# EAGLE design LoRa_RFM98W_Shield (EAGLE 9.6.2)
CNAME: LoRa Shield; CREVISION: V1.1

## Sheet 1 of 2
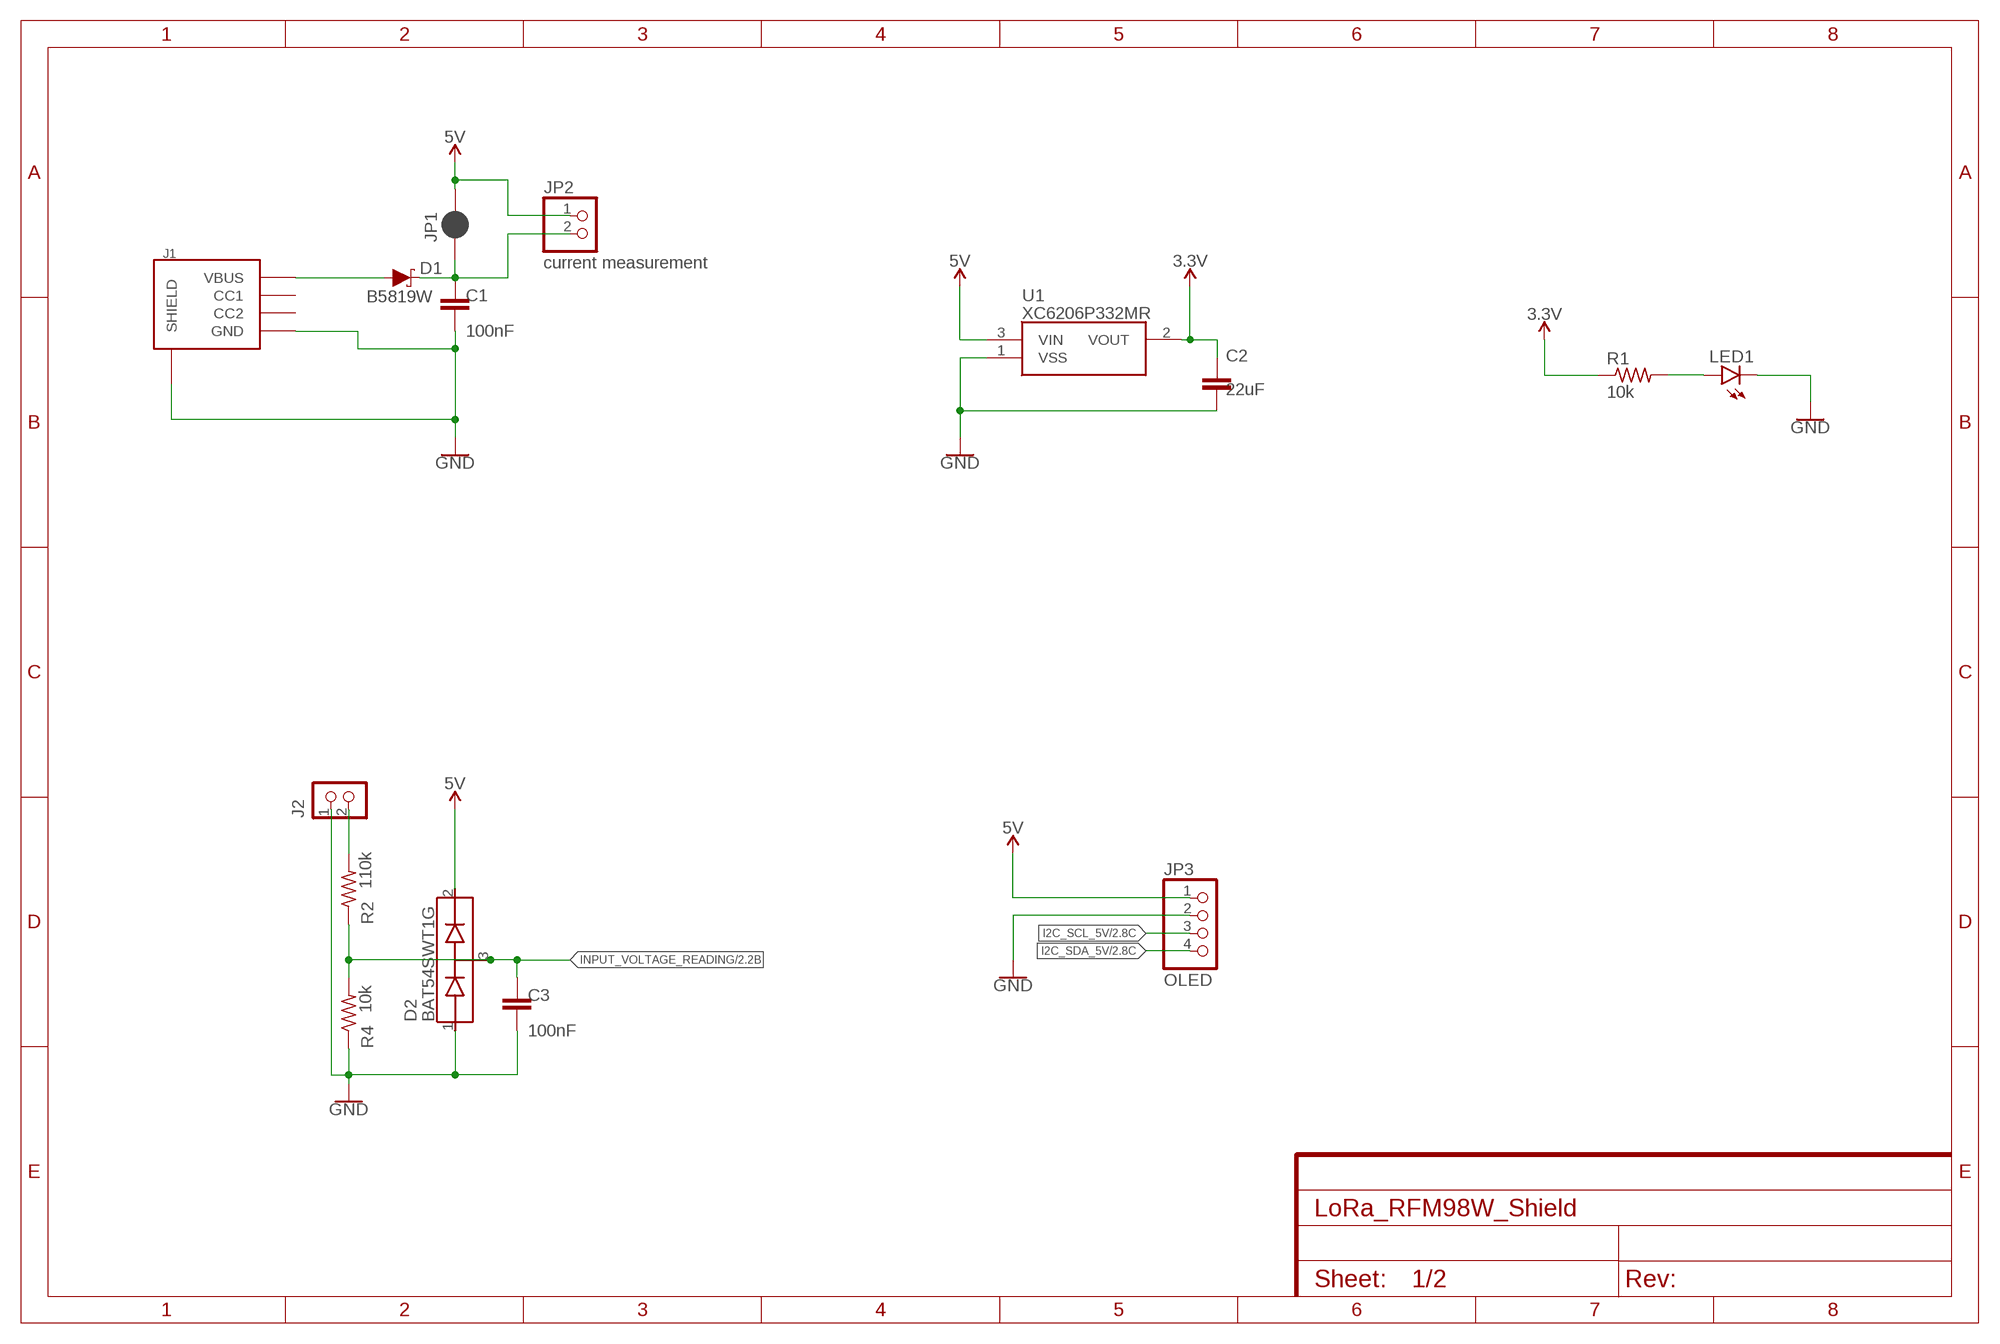
[diagram p0: schematic, sheet 1]

### Parts
C1  100nF  C-NON-POLC0603  [C0603]
C2  22uF  C-NON-POLC0805  [C0805]
C3  100nF  C-NON-POLC0603  [C0603]
D1  B5819W  DIODE-SCHOTTKY_SOD-123  [SOD-123]
D2  BAT54SWT1G  [SOT65P220X100-3N]
J1  USB-TYPE-C-31-M-17  [USB-TYPE-C-31-M-17]
J2  CON_TERMINAL_BLOCK_02-5MM  [TERMINAL_BLOCK_2P_5]
JP1  JUMPER-SMT_2_NC_PASTE_SILK  [SMT-JUMPER_2_NC_PASTE_SILK]
JP2  current measurement  PINHD-1X2/OCT  [1X02/OCT]
JP3  OLED  PINHD-1X4/OCT  [1X04/OCT]
LED1  LEDCHIPLED_0805  [CHIPLED_0805]
R1  10k  RR0603  [R0603]
R2  110k  RR0603  [R0603]
R4  10k  RR0603  [R0603]
U1  XC6206P332MR  [SOT95P280X130-3N]

### Nets
3.3V [power]: C2.2 R1.1 U1.2(VOUT) ; also sheet 2
5V [power]: D2.2(CATHODE) JP1.2 JP2.1 JP3.1 U1.3(VIN) ; also sheet 2
GND [power]: C1.2 C2.1 C3.2 D2.1(ANODE) J1.GND J1.GND_2(GND) J1.SHLD-B1(SHIELD) J1.SHLD-B2(SHIELD) J1.SHLD-B3(SHIELD) J1.SHLD-B4(SHIELD) J1.SHLD-T1(SHIELD) J1.SHLD-T2(SHIELD) J1.SHLD-T3(SHIELD) J1.SHLD-T4(SHIELD) J2.1 JP3.2 LED1.C R4.1 U1.1(VSS) ; also sheet 2
I2C_SCL_5V: JP3.3 ; also sheet 2
I2C_SDA_5V: JP3.4 ; also sheet 2
INPUT_VOLTAGE_READING: C3.1 D2.3(CATHODE-ANODE) R2.1 R4.2 ; also sheet 2
N$1 [power]: D1.A J1.VBUS J1.VBUS_2(VBUS)
N$4 [power]: LED1.A R1.2
N$8: J2.2 R2.2
N$16 [power]: C1.1 D1.C JP1.1 JP2.2
Unconnected: J1.CC1 J1.CC2

## Sheet 2 of 2
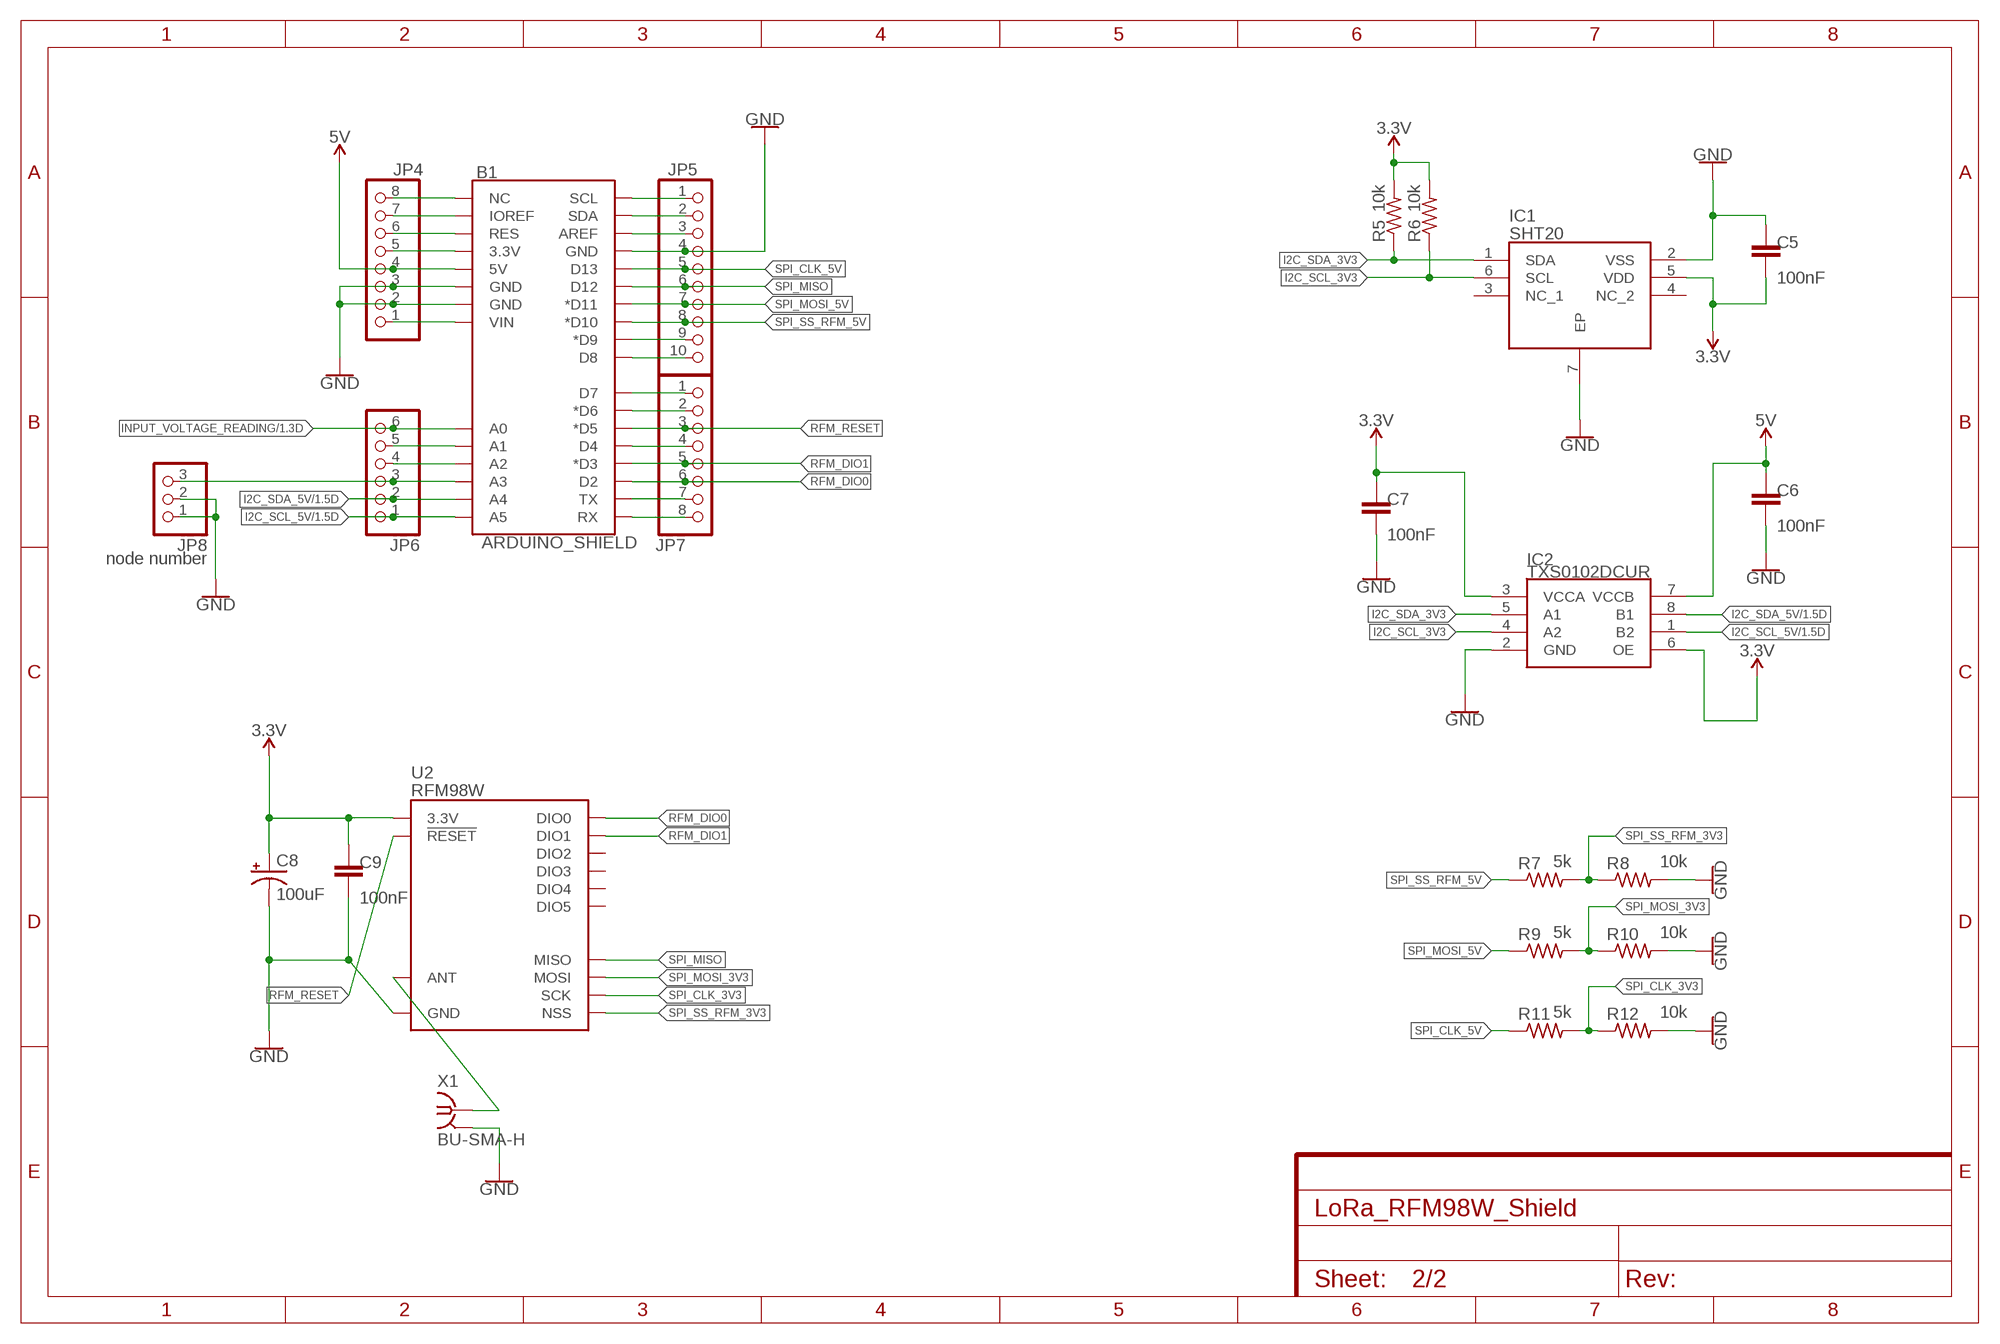
[diagram p1: schematic, sheet 2]

### Parts
B1  ARDUINO_SHIELD  ARDUINO_UNO_R3_SHIELDUNO_R3_SHIELD_NOLABELS_LOCK  [UNO_R3_SHIELD_NOLABELS_LOCK]
C5  100nF  C-NON-POLC0603  [C0603]
C6  100nF  C-NON-POLC0603  [C0603]
C7  100nF  C-NON-POLC0603  [C0603]
C8  100uF  CPOL-USSMCB  [SMC_B]
C9  100nF  C-NON-POLC0603  [C0603]
IC1  SHT20  [SON100P300X300X110-7N]
IC2  TXS0102DCUR  [SOP50P310X90-8N]
JP4  PINHD-1X8/OCT  [1X08/OCT]
JP5  PINHD-1X10/OCT  [1X10/OCT]
JP6  PINHD-1X6/OCT  [1X06/OCT]
JP7  PINHD-1X8/OCT  [1X08/OCT]
JP8  node number  PINHD-1X3/OCT  [1X03/OCT]
R5  10k  RR0603  [R0603]
R6  10k  RR0603  [R0603]
R7  5k  RR0603  [R0603]
R8  10k  RR0603  [R0603]
R9  5k  RR0603  [R0603]
R10  10k  RR0603  [R0603]
R11  5k  RR0603  [R0603]
R12  10k  RR0603  [R0603]
U2  RFM98W  RFM95W  [RFM95/96/97/98W]
X1  BU-SMA-H  [BU-SMA-H]

### Nets
3.3V [power]: C5.2 C7.1 C8.+ C9.1 IC1.5(VDD) IC2.3(VCCA) IC2.6(OE) R5.2 R6.2 U2.3.3V ; also sheet 1
5V [power]: B1.5V C6.1 IC2.7(VCCB) JP4.4 ; also sheet 1
GND [power]: B1.GND@0(GND) B1.GND@1(GND) B1.GND@2(GND) C5.1 C6.2 C7.2 C8.- C9.2 IC1.2(VSS) IC1.7(EP) IC2.2(GND) JP4.2 JP4.3 JP5.4 JP8.1 JP8.2 R8.2 R10.2 R12.2 U2.GND@1(GND) U2.GND@2(GND) U2.GND@3(GND) X1.2 X1.3 X1.4 X1.5 ; also sheet 1
I2C_SCL_3V3: IC1.6(SCL) IC2.4(A2) R6.1
I2C_SCL_5V: B1.A5 IC2.1(B2) JP6.1 ; also sheet 1
I2C_SDA_3V3: IC1.1(SDA) IC2.5(A1) R5.1
I2C_SDA_5V: B1.A4 IC2.8(B1) JP6.2 ; also sheet 1
INPUT_RELAY_STATUS: B1.A1 JP6.5
INPUT_VOLTAGE_READING: B1.A0 JP6.6 ; also sheet 1
N$2 [RF]: U2.ANT X1.1
N$3: B1.SCL JP5.1
N$5: B1.SDA JP5.2
N$6: B1.AREF JP5.3
N$7: B1.VIN JP4.1
N$10: B1.D4 JP7.4
N$12: B1.D9(*D9) JP5.9
N$13: B1.D8 JP5.10
N$14: B1.D7 JP7.1
N$15: B1.D6(*D6) JP7.2
N$20: B1.TX JP7.7
N$21: B1.RX JP7.8
N$23: B1.3.3V JP4.5
N$24: B1.RES JP4.6
N$25: B1.IOREF JP4.7
N$26: B1.NC JP4.8
N$29: B1.A2 JP6.4
N$30: B1.A3 JP6.3 JP8.3
RFM_DIO0: B1.D2 JP7.6 U2.DIO0
RFM_DIO1: B1.D3(*D3) JP7.5 U2.DIO1
RFM_RESET: B1.D5(*D5) JP7.3 U2.!RESET
SPI_CLK_3V3: R11.2 R12.1 U2.SCK
SPI_CLK_5V: B1.D13 JP5.5 R11.1
SPI_MISO: B1.D12 JP5.6 U2.MISO
SPI_MOSI_3V3: R9.2 R10.1 U2.MOSI
SPI_MOSI_5V: B1.D11(*D11) JP5.7 R9.1
SPI_SS_RFM_3V3: R7.2 R8.1 U2.NSS
SPI_SS_RFM_5V: B1.D10(*D10) JP5.8 R7.1
Unconnected: IC1.3(NC_1) IC1.4(NC_2) U2.DIO2 U2.DIO3 U2.DIO4 U2.DIO5

## Library data of the parts
B1 = angrypig7_Library:ARDUINO_UNO_R3_SHIELD: Arduino R3 Shield Footprint Shield form compatible with the Arduino Uno R3. SparkFun Products: MG2639 Cellular Shield <https://www.sparkfun.com/products/13120> MIDI Shield <https://www.sparkfun.com/products/12898> R3 Stackable Headers Kit <https://www.sparkfun.com/products/11417>
C1-C3 C5-C7 C9 = angrypig7-RCL:C-NON-POL; SPICEPREFIX: C
C8 = rcl:CPOL-US: POLARIZED CAPACITOR, American symbol; SPICEPREFIX: C
D1 = angrypig7-Diodes:DIODE-SCHOTTKY
D2 = SamacSys_Parts:BAT54SWT1G: Dual Series Schottky Barrier Diodes Source: Datasheet <https://datasheet.lcsc.com/szlcsc/ON-Semicon-ON-BAT54SWT1G_C78260.pdf>; DESCRIPTION: Dual Series Schottky Barrier Diodes; HEIGHT: 1mm; LCSC_PART_NUMBER: C78260; LCSC_PRICE-STOCK: https://lcsc.com/product-detail/Schottky-Barrier-Diodes-SBD_ON-Semicon_BAT54SWT1G_ON-Semicon-ON-BAT54SWT1G_C78260.html; MANUFACTURER_NAME: ON Semiconductor; MANUFACTURER_PART_NUMBER: BAT54SWT1G
IC1 = SamacSys_Parts:SHT20: Sensirion SHT20, Temperature & Humidity Sensor -40 +125 C +/-3 (Humidity) %RH, +/-3 (Temperature) C Source: Datasheet <https://datasheet.lcsc.com/szlcsc/Sensirion-SHT20_C53865.pdf>; DESCRIPTION: Sensirion SHT20, Temperature & Humidity Sensor -40 +125 C +/-3 (Humidity) %RH, +/-3 (Temperature) C; HEIGHT: 1.1mm; LCSC_PART_NUMBER: C53865; LCSC_PRICE-STOCK: https://lcsc.com/product-detail/Temperature-Humidity-Sensors_Sensirion_SHT20_Sensirion-SHT20_C53865.html; MANUFACTURER_NAME: Sensirion; MANUFACTURER_PART_NUMBER: SHT20
IC2 = SamacSys_Parts:TXS0102DCUR: 2-Bit Bidirectional Voltage-Level Shifter for Open-Drain and Push-Pull Application Source: Datasheet <https://datasheet.lcsc.com/szlcsc/Texas-Instruments-TI-TXS0102DCUR_C53434.pdf>; DESCRIPTION: 2-Bit Bidirectional Voltage-Level Shifter for Open-Drain and Push-Pull Application; HEIGHT: 0.9mm; LCSC_PART_NUMBER: C53434; LCSC_PRICE-STOCK: https://lcsc.com/product-detail/Level-Translators-Shifters_Texas-Instruments_TXS0102DCUR_Texas-Instruments-Texas-Instruments-TXS0102DCUR_C53434.html; MANUFACTURER_NAME: Texas Instruments; MANUFACTURER_PART_NUMBER: TXS0102DCUR
J1 = angrypig7-Connectors:USB-TYPE-C-31-M-17: Type-C-31-M16/17 By Korean Hroparts Elec link <https://lcsc.com/product-detail/Others_Korean-Hroparts-Elec-TYPE-C-31-M-17_C283540.html>
J2 = dp_devices:CON_TERMINAL_BLOCK_02: 2 poles wire to board terminal block
JP1 = SparkFun-Jumpers:JUMPER-SMT_2_NC_PASTE: Normally closed solder jumper This jumper has an aperture in the stencil to allow solder paste to bridge the split in the wire so it's normally closed (NC). Wick off the solder to open the connection. Reapply solder to reclose the connection.
JP2 = pinhead_v2:PINHD-1X2: PIN HEADER
JP3 = pinhead_v2:PINHD-1X4: PIN HEADER
JP4 JP7 = pinhead_v2:PINHD-1X8: PIN HEADER
JP5 = pinhead_v2:PINHD-1X10: PIN HEADER
JP6 = pinhead_v2:PINHD-1X6: PIN HEADER
JP8 = pinhead_v2:PINHD-1X3: PIN HEADER
LED1 = led:LED: LED OSRAM: - CHIPLED LG R971, LG N971, LY N971, LG Q971, LY Q971, LO R971, LY R971 LH N974, LH R974 LS Q976, LO Q976, LY Q976 LO Q996 - Hyper CHIPLED LW Q18S LB Q993, LB Q99A, LB R99A - SideLED LS A670, LO A670, LY A670, LG A670, LP A670 LB A673, LV A673, LT A673, LW A673 LH A674 LY A675 LS A676, LA A676, LO A676, LY A676, LW A676 LS A679, LY A679, LG A679 - Hyper Micro SIDELED® LS Y876, LA Y876, LO Y876, LY Y876 LT Y87S - SmartLED LW L88C, LW L88S LB L89C, LB L89S, LG L890 LS L89K, LO L89K, LY L89K LS L896, LA L896, LO L896, LY L896 - TOPLED LS T670, LO T670, LY T670, LG T670, LP T670 LSG T670, LSP T670, LSY T670, LOP T670, LYG T670 LG T671, LOG T671, LSG T671 LB T673, LV T673, LT T673, LW T673 LH T674 LS T676, LA T676, LO T676, LY T676, LB T676, LH T676, LSB T676, LW T676 LB T67C, LV T67C, LT T67C, LS T67K, LO T67K, LY T67K, LW E67C LS E67B, LA E67B, LO E67B, LY E67B, LB E67C, LV E67C, LT E67C LW T67C LS T679, LY T679, LG T679 LS T770, LO T770, LY T770, LG T770, LP T770 LB T773, LV T773, LT T773, LW T773 LH T774 LS E675, LA E675, LY E675, LS T675 LS T776, LA T776, LO T776, LY T776, LB T776 LHGB T686 LT T68C, LB T68C - Hyper Mini TOPLED® LB M676 - Mini TOPLED Santana® LG M470 LS M47K, LO M47K, LY M47K Source: http://www.osram.convergy.de LUXEON: - LUMILED® LXK2-PW12-R00, LXK2-PW12-S00, LXK2-PW14-U00, LXK2-PW14-V00 LXK2-PM12-R00, LXK2-PM12-S00, LXK2-PM14-U00 LXK2-PE12-Q00, LXK2-PE12-R00, LXK2-PE12-S00, LXK2-PE14-T00, LXK2-PE14-U00 LXK2-PB12-K00, LXK2-PB12-L00, LXK2-PB12-M00, LXK2-PB14-N00, LXK2-PB14-P00, LXK2-PB14-Q00 LXK2-PR12-L00, LXK2-PR12-M00, LXK2-PR14-Q00, LXK2-PR14-R00 LXK2-PD12-Q00, LXK2-PD12-R00, LXK2-PD12-S00 LXK2-PH12-R00, LXK2-PH12-S00 LXK2-PL12-P00, LXK2-PL12-Q00, LXK2-PL12-R00 Source: www.luxeon.com KINGBRIGHT: KA-3528ASYC Source: www.kingbright.com
R1 R2 R4-R12 = angrypig7-RCL:R; SPICEPREFIX: R
U1 = SamacSys_Parts:XC6206P332MR: Low ESR Cap.Compatible Postive Voltage Regulators Source: Datasheet <http://www.torexsemi.com/products/voltage_regulators/data/XC6206.pdf>; DESCRIPTION: Low ESR Cap.Compatible Postive Voltage Regulators; HEIGHT: 1.3mm; MANUFACTURER_NAME: Torex; MANUFACTURER_PART_NUMBER: XC6206P332MR
U2 = SparkFun-RF:RFM95W: RFM95/96/97/98 The RFM95/96/97/98(W) transceivers feature the LoRaTM long range modem that provides ultra-long range spread spectrum communication and high interference immunity whilst minimising current consumption. These devices also support high performance (G)FSK modes for systems including WMBus, IEEE802.15.4g. The RFM95/96/97/98(W) deliver exceptional phase noise, selectivity, receiver linearity and IIP3 for significantly lower current consumption than competing devices Datasheet <http://www.hoperf.com/upload/rf/RFM95_96_97_98W.pdf>; PROD_ID: IC-13959
X1 = con-coax:BU-SMA-H: FEMALE SMA CONNECTOR Radiall; OC_FARNELL: unknown; OC_NEWARK: unknown

## Net classes
0 default: width 0.203 mm
1 power: width 0.508 mm
2 RF: width 0.762 mm

## Board
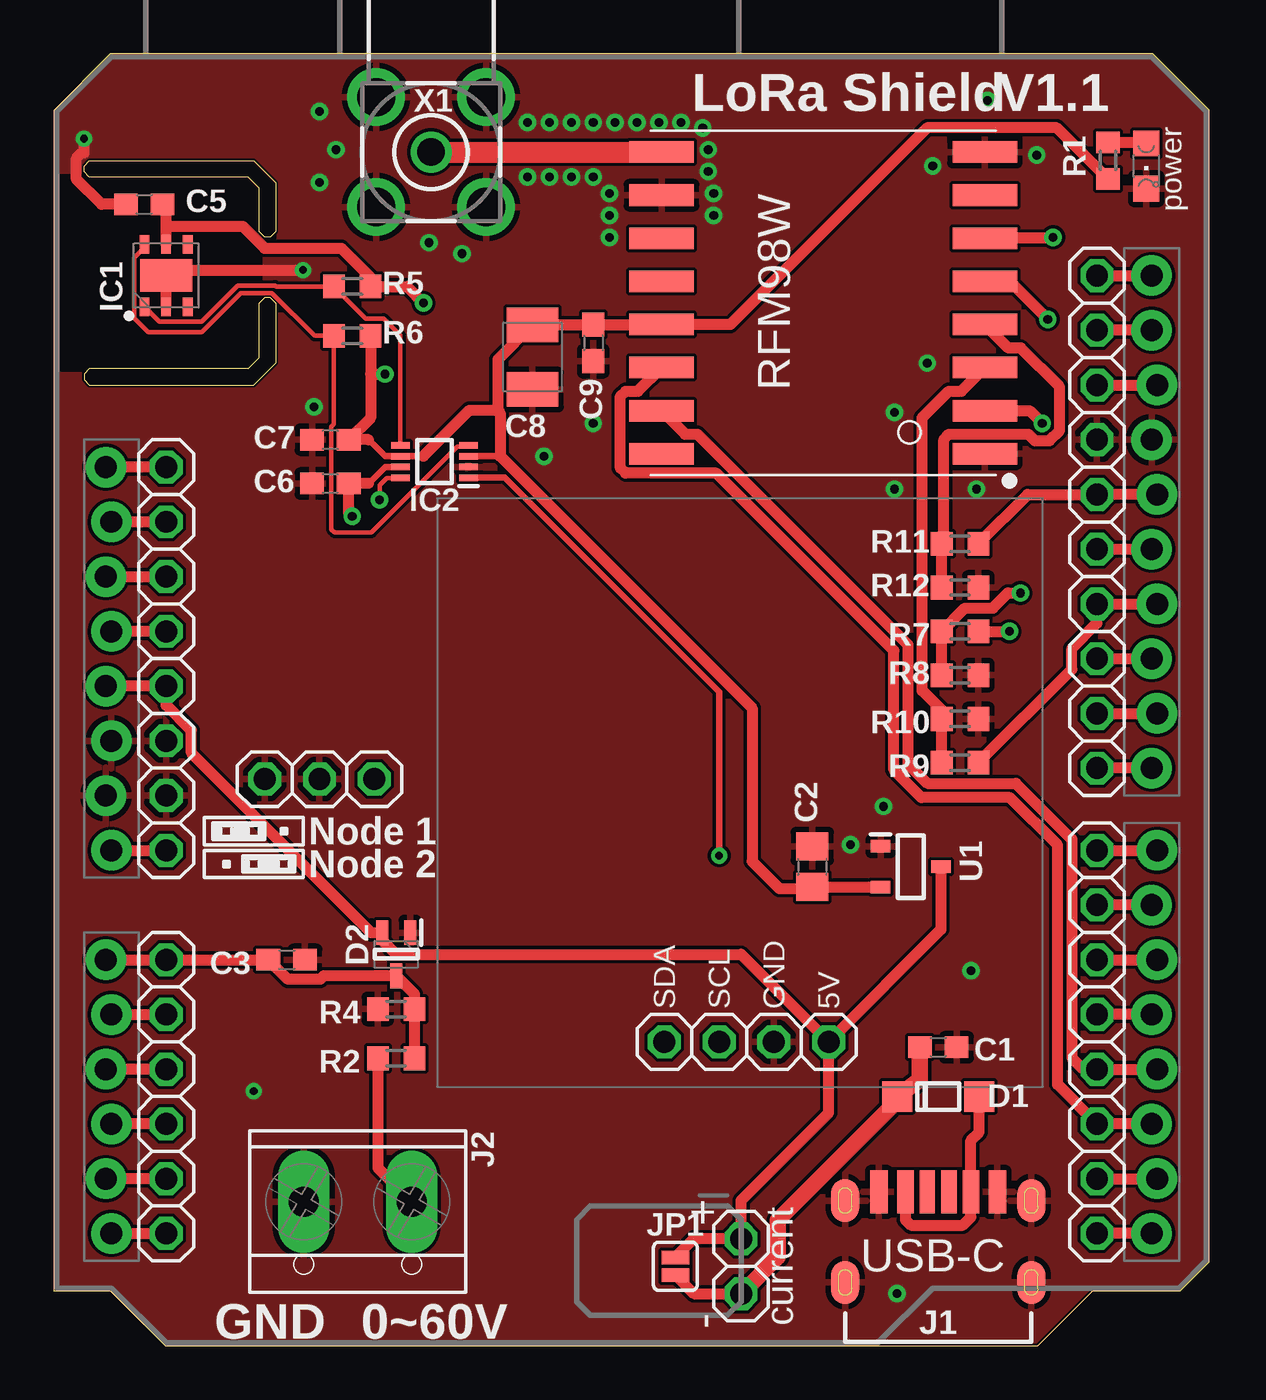
[diagram p2: board, top side]
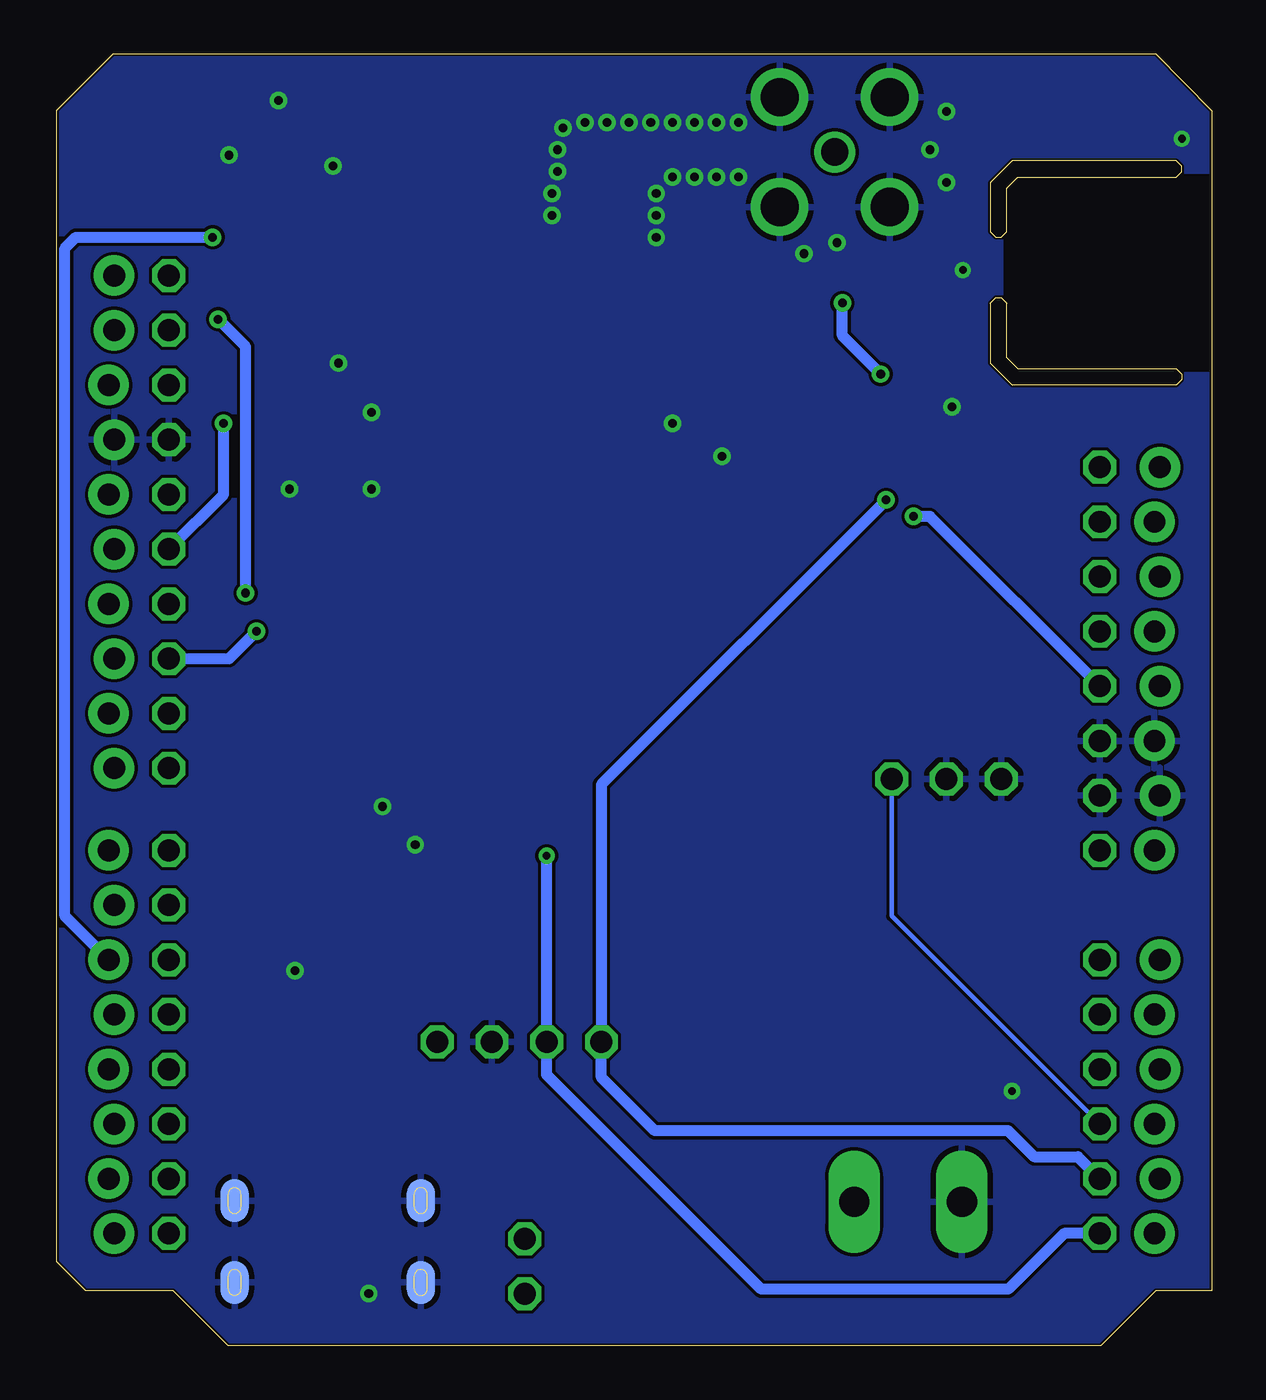
[diagram p3: board, bottom side, seen from below]

Size 53.59 x 59.94 mm. Coordinates in mm from the lower left corner, seen from the top.
Outline: 53.59,3.89 53.59,57.33 50.98,59.94 2.62,59.94 0,57.3 0,2.54 2.62,2.54 5.16,0 45.64,0 48.18,2.54 52.25,2.54 53.59,3.89
Outline: 1.4,45.09 1.4,44.83 1.65,44.58 9.27,44.58 10.29,45.59 10.29,48.39 10.03,48.64 9.78,48.64 9.53,48.39 9.53,45.85 9.02,45.34 1.65,45.34 1.4,45.09
Outline: 1.4,54.48 1.4,54.74 1.65,54.99 9.27,54.99 10.29,53.98 10.29,51.69 10.03,51.44 9.78,51.44 9.53,51.69 9.53,53.72 9.02,54.23 1.65,54.23 1.4,54.48
Copper layers (1*16): Top 0.035mm / dielectric 1.5mm / Bottom 0.035mm
Design rules "default *": minimum track width 6mil, minimum drill 0.35mm, track to track 6mil, track to pad 6mil, pad to pad 6mil, via to via 6mil, smd to smd 6mil, copper to edge 4mil, drill to drill 6mil, minimum pad ring 10mil, minimum via ring 8mil, stop-mask expansion 4mil, vias tented up to drill 20mil, thermal gap 10mil

### Footprints (pad centres in the part's own frame; a part is rotated, then mirrored left to right if it is on the bottom)
UNO_R3_SHIELD_NOLABELS_LOCK = drill 1.016 pad 1.88: 3.3V 24.13,-3.81; 5V 24.384,-1.27; A0 24.384,11.43; A1 24.13,13.97; A2 24.384,16.51; A3 24.13,19.05; A4 24.384,21.59; A5 24.13,24.13; AREF -24.384,-15.24; D2 -24.13,19.05; D3 -24.384,16.51; D4 -24.13,13.97; D5 -24.384,11.43; D6 -24.13,8.89; D7 -24.384,6.35; D8 -24.13,2.54; D9 -24.384,0; D10 -24.13,-2.54; D11 -24.384,-5.08; D12 -24.13,-7.62; D13 -24.384,-10.16; GND@0 24.13,1.27; GND@1 24.384,3.81; GND@2 -24.13,-12.7; IOREF 24.13,-8.89; NC 24.384,-11.43; RES 24.384,-6.35; RX -24.13,24.13; SCL -24.13,-20.32; SDA -24.13,-17.78; TX -24.384,21.59; VIN 24.13,6.35
C0603 = smd 1.1 x 1: 1 -0.85,0; 2 0.85,0
C0805 = smd 1.3 x 1.5: 1 -0.95,0; 2 0.95,0
SMC_B = smd 1.6 x 2.4: + -1.5,0; - 1.5,0
SOD-123 = smd 1.4 x 1.4: A 1.9,0; C -1.9,0
SOT65P220X100-3N = smd 1.15 x 0.55: 1 -1,0.65; 2 -1,-0.65; 3 1,0
SON100P300X300X110-7N = smd 0.85 x 0.45: 1 -1.45,1; 2 -1.45,0; 3 -1.45,-1; 4 1.45,-1; 5 1.45,0; 6 1.45,1 | smd 1.5 x 2.4: 7 0,0
SOP50P310X90-8N = smd 0.85 x 0.3: 1 -1.575,0.75; 2 -1.575,0.25; 3 -1.575,-0.25; 4 -1.575,-0.75; 5 1.575,-0.75; 6 1.575,-0.25; 7 1.575,0.25; 8 1.575,0.75
USB-TYPE-C-31-M-17 = smd 0.7 x 2: CC1 -0.5,0.4; CC2 0.5,0.4 | smd 0.8 x 2: GND -2.75,0.4; GND_2 2.75,0.4 | smd 1.3 x 2 bottom: SHLD-B1 -4.32,0; SHLD-B2 4.32,0; SHLD-B3 -4.32,-3.8; SHLD-B4 4.32,-3.8 | smd 1.3 x 2: SHLD-T1 -4.32,0; SHLD-T2 4.32,0; SHLD-T3 -4.32,-3.8; SHLD-T4 4.32,-3.8 | smd 0.76 x 2: VBUS -1.52,0.4; VBUS_2 1.52,0.4
TERMINAL_BLOCK_2P_5 = drill 1.4 pad 2.38 long: 1 2.5,-0.45; 2 -2.5,-0.45
SMT-JUMPER_2_NC_PASTE_SILK = smd 0.635 x 1.27: 1 -0.406,0; 2 0.406,0
1X02/OCT = drill 1.016 octagon: 1 -1.27,0; 2 1.27,0
1X04/OCT = drill 1.016 octagon: 1 -3.81,0; 2 -1.27,0; 3 1.27,0; 4 3.81,0
1X08/OCT = drill 1.016 octagon: 1 -8.89,0; 2 -6.35,0; 3 -3.81,0; 4 -1.27,0; 5 1.27,0; 6 3.81,0; 7 6.35,0; 8 8.89,0
1X10/OCT = drill 1.016 octagon: 1 -11.43,0; 2 -8.89,0; 3 -6.35,0; 4 -3.81,0; 5 -1.27,0; 6 1.27,0; 7 3.81,0; 8 6.35,0; 9 8.89,0; 10 11.43,0
1X06/OCT = drill 1.016 octagon: 1 -6.35,0; 2 -3.81,0; 3 -1.27,0; 4 1.27,0; 5 3.81,0; 6 6.35,0
1X03/OCT = drill 1.016 octagon: 1 -2.54,0; 2 0,0; 3 2.54,0
CHIPLED_0805 = smd 1.2 x 1.2: A 0,-1.05; C 0,1.05
R0603 = smd 1 x 1.1: 1 -0.85,0; 2 0.85,0
SOT95P280X130-3N = smd 0.9 x 0.6: 1 -1.4,0.95; 2 -1.4,-0.95; 3 1.4,0
RFM95/96/97/98W = smd 3 x 1: 3.3V 7.5,1; !RESET -7.5,-3; ANT 7.5,-7; DIO0 7.5,3; DIO1 7.5,5; DIO2 7.5,7; DIO3 7.5,-3; DIO4 7.5,-1; DIO5 -7.5,-5; GND@1 -7.5,7; GND@2 -7.5,-7; GND@3 7.5,-5; MISO -7.5,5; MOSI -7.5,3; NSS -7.5,-1; SCK -7.5,1
BU-SMA-H = drill 1.27: 1 0,0 | drill 1.778: 2 -2.55,2.55; 3 2.55,2.55; 4 2.55,-2.55; 5 -2.55,-2.55

### Placement (x,y rotation side)
B1  26.8,29.34 180 top
C1  41.02,13.84 0 top
C2  35.18,22.23 270 top
C3  10.79,17.91 0 top
C5  4.19,52.96 0 top
C6  12.83,40.01 180 top
C7  12.83,42.04 180 top
C8  22.2,45.87 270 top
C9  25.02,46.53 270 top
D1  41.02,11.56 0 top
D2  15.88,18.16 270 top
IC1  5.21,49.66 90 top
IC2  17.65,41.02 180 top
J1  41.02,6.73 0 top
J2  14.1,6.22 180 top
JP1  28.83,3.68 90 top
JP2  31.88,3.68 270 top
JP3  32.13,14.1 180 top
JP4  5.21,31.88 90 top
JP5  48.39,38.23 270 top
JP6  5.21,11.56 90 top
JP7  48.39,14.1 270 top
JP8  12.32,26.29 0 top
LED1  50.67,54.74 180 top
R1  48.9,54.99 90 top
R2  15.88,13.34 180 top
R4  15.88,15.62 0 top
R5  13.84,49.15 0 top
R6  13.84,46.86 0 top
R7  42.04,33.15 180 top
R8  42.04,31.12 0 top
R9  42.04,27.05 180 top
R10  42.04,29.08 0 top
R11  42.04,37.21 180 top
R12  42.04,35.18 0 top
U1  39.75,22.23 0 top
U2  35.69,48.39 180 top
X1  17.5,55.38 90 top

### Tracks (layer width: path | path; a pad name or v marks a point on that pad's centre or on a via)
3.3V  (via drill 0.4)
  Top 0.305: 14.61,42.04 15.37,41.27 IC2.6 17.14,41.27 | IC2.3 20.7,41.27
  Top 0.508: R6.2 14.69,45.09 | 14.69,45.09 14.69,43.05 C7.1 14.61,42.04 | R1.1 46.52,56.52 40.51,56.52 31.38,47.39 U2.3.3V C9.1 25.01,47.37 C8.+ 20.59,45.77 20.59,43.4 | 20.59,43.4 20.7,43.3 20.7,41.27 32.38,29.59 32.38,22.48 33.66,21.21 35.11,21.21 C2.2 U1.2 | v17.14,48.39 16.38,49.15 R5.2 14.69,49.57 13.34,50.93 9.78,50.93 8.76,51.94 5.21,51.94 | 14.69,45.09 v15.37,45.09 | 20.59,43.4 19.27,43.4 17.14,41.27 | C5.2 5.21,52.96 5.21,51.94 | IC1.5 5.21,51.94
  Bottom 0.508: v15.37,45.09 17.14,46.86 v17.14,48.39
5V  (via drill 0.4)
  Top 0.305: IC2.7 15.37,40.77 14.61,40.01
  Top 0.508: 14.61,40.01 C6.1 13.68,38.65 v13.84,38.48 | B1.5V JP4.4 5.21,29.72 6.38,28.55 6.38,27.5 14.72,19.16 D2.2 15.23,18.81 15.88,18.16 31.88,18.16 JP3.1 | JP1.2 29.69,4.95 JP2.1 31.88,6.74 35.94,10.8 JP3.1 | JP3.1 41.15,19.31 U1.3
  Bottom 0.508: JP4.4 13.08,38.48 v13.84,38.48
GND  (via drill 0.35, 0.4)
  Top 0.508: IC1.2 IC1.7 5.21,49.91 v11.56,49.91 | v1.4,56.01 1.4,55.35 1.29,55.35 1.04,55.09 1.04,54.13 2.21,52.96 C5.1
  other vias: 30.35,54.48 30.35,55.5 30.1,56.52 29.08,56.77 28.07,56.77 27.05,56.77 26.04,56.77 25.02,56.77 24,56.77 22.99,56.77 21.97,56.77 21.97,54.23 22.99,54.23 24,54.23 25.02,54.23 25.78,53.47 43.31,57.79 40.77,54.74 45.59,55.24 36.96,23.24 38.48,25.02 42.55,17.4 39.12,2.41 12.06,43.56 42.8,39.75 38.99,43.31 40.51,45.59 38.99,39.75 30.61,53.47 25.02,42.8 22.73,41.27 30.61,52.45 25.78,52.45 25.78,51.44 18.92,50.67 17.4,51.18 12.32,53.98 13.08,55.5 12.32,57.28 9.27,11.81
  pour Top: 57.28,62.36 -1.14,62.36 -1.14,-3.68 57.28,-3.68
  pour Bottom: 57.28,-3.68 57.28,62.36 -1.14,62.36 -1.14,-3.68
  cutout Top: 9.53,54.23 9.53,45.34 0.13,45.34 0.13,54.23
  cutout Bottom: 9.53,54.23 9.53,45.34 0.13,45.34 0.13,54.23
I2C_SCL_3V3
  Top 0.203: IC2.4 19.18,41.73 18.72,41.73 14.72,37.73 13.02,37.73 12.87,37.88 12.87,42.64 12.99,42.76 R6.1 12.1,46.86 10.12,48.84 8.68,48.84 6.86,47.02 4.38,47.02 3.73,47.68 3.73,50.49 4.21,50.97 IC1.6
I2C_SCL_5V  (via drill 0.35)
  Top 0.305: v30.86,22.73 30.86,30.32 20.91,40.27 IC2.1
  Top 0.508: B1.A5 JP6.1
  Bottom 0.508: JP6.1 6.86,5.21 9.45,2.62 20.91,2.62 30.86,12.57 JP3.3 v30.86,22.73
I2C_SDA_3V3
  Top 0.203: IC2.5 16.08,46.89 15.3,47.67 14.48,47.67 R5.1 10.31,49.15 10.26,49.2 8.53,49.2 6.86,47.53 4.88,47.53 4.73,47.68 4.73,47.69 IC1.1
I2C_SDA_5V  (via drill 0.4)
  Top 0.203: IC2.8 16.07,40.26 15.43,40.26 15.11,39.94 v15.11,39.24
  Top 0.508: JP6.2 B1.A4
  Bottom 0.508: JP6.2 6.22,8.76 8.25,8.76 9.45,9.97 25.84,9.97 28.32,12.45 JP3.4 28.32,26.04 v15.11,39.24
INPUT_RELAY_STATUS
  Top 0.508: B1.A1 JP6.5
INPUT_VOLTAGE_READING
  Top 0.508: B1.A0 JP6.6 C3.1 10.85,17 12.36,17 12.52,17.16 D2.3 16.73,16.31 R4.2 R2.1
N$1
  Top 0.508: J1.VBUS 39.5,5.84 39.75,5.59 42.16,5.59 42.54,5.96 J1.VBUS_2 42.54,9.52 42.92,9.9 D1.A
N$2
  Top 0.762: U2.ANT
  Top 0.965: X1.1 U2.ANT
N$3
  Top 0.508: JP5.1 B1.SCL
N$4
  Top 0.508: R1.2 50.62,55.84 LED1.A
N$5
  Top 0.508: B1.SDA JP5.2
N$6
  Top 0.508: JP5.3 B1.AREF
N$7
  Top 0.508: B1.VIN JP4.1
N$8
  Top 0.508: R2.2 15.02,8.25 J2.2
N$10
  Top 0.508: B1.D4 JP7.4
N$12
  Top 0.508: JP5.9 B1.D9
N$13
  Top 0.508: B1.D8 JP5.10
N$14
  Top 0.508: JP7.1 B1.D7
N$15
  Top 0.508: B1.D6 JP7.2
N$16
  Top 0.508: JP2.2 29.69,2.41 JP1.1
  Top 0.762: C1.1 40.17,12.34 D1.C 39.33,11.56 33.58,5.81 33.58,4.12 JP2.2
N$20
  Top 0.508: JP7.7 B1.TX
N$21
  Top 0.508: B1.RX JP7.8
N$23
  Top 0.508: JP4.5 B1.3.3V
N$24
  Top 0.508: B1.RES JP4.6
N$25
  Top 0.508: JP4.7 B1.IOREF
N$26
  Top 0.508: JP4.8 B1.NC
N$29
  Top 0.508: JP6.4 B1.A2
N$30
  Top 0.508: JP6.3 B1.A3
  Bottom 0.203: JP8.3 14.86,19.94 JP6.3
RFM_DIO0
  Top 0.508: B1.D2 JP7.6 46.56,12.12 46.56,23.22 44.35,25.43 40.24,25.43 38.96,26.72 38.96,32.26 30.73,40.48 26.52,40.48 26.28,40.72 26.28,44.05 26.52,44.29 27.09,44.29 U2.DIO0
RFM_DIO1
  Top 0.508: B1.D3 JP7.5 47.75,12.83 47.22,13.36 47.22,23.5 44.62,26.09 40.52,26.09 39.62,26.99 39.62,32.53 29.85,42.29 29.28,42.29 U2.DIO1
RFM_RESET  (via drill 0.4)
  Top 0.508: JP7.3 B1.D5 | v46.35,51.44 46.31,51.39 U2.!RESET
  Bottom 0.508: B1.D5 53.21,19.94 53.21,50.93 52.7,51.44 v46.35,51.44
SPI_CLK_3V3
  Top 0.508: R12.1 R11.2 41.28,37.3 41.28,42.05 41.52,42.29 45.21,42.29 45.51,41.99 46.18,41.99 46.66,42.46 46.66,44.49 44.85,46.29 44.28,46.29 U2.SCK
SPI_CLK_5V
  Top 0.508: R11.1 45.17,39.5 JP5.5 B1.D13
SPI_MISO  (via drill 0.4)
  Top 0.508: JP5.6 B1.D12 | U2.MISO 45.26,43.39 v45.85,42.8
  Bottom 0.508: JP5.6 45.85,39.5 v45.85,42.8
SPI_MOSI_3V3
  Top 0.508: R9.2 R10.1 41.19,29.49 40.28,30.4 40.28,43.05 41.52,44.29 42.09,44.29 U2.MOSI
SPI_MOSI_5V
  Top 0.508: B1.D11 JP5.7 48.39,33.53 47.22,32.36 47.22,31.38 R9.1
SPI_SS_RFM_3V3  (via drill 0.4)
  Top 0.508: R8.1 R7.2 42.26,34.22 43.55,34.22 44.26,34.92 v44.83,34.92 | v46.1,47.62 44.34,49.39 U2.NSS
  Bottom 0.508: v44.83,34.92 44.83,46.35 v46.1,47.62
SPI_SS_RFM_5V  (via drill 0.4)
  Top 0.508: JP5.8 B1.D10 | R7.1 v44.32,33.15
  Bottom 0.508: JP5.8 45.59,31.88 v44.32,33.15

### Text on the board
tPlace: power | RFM98W | Node 1 | Node 2 | SDA | SCL | GND | 5V | + | USB-C | current | GND | 0~60V | -